# Altium schematic sheet 03_MCU_STM32.SchDoc
size A3; SheetNumber: 3; SheetTotal: 9
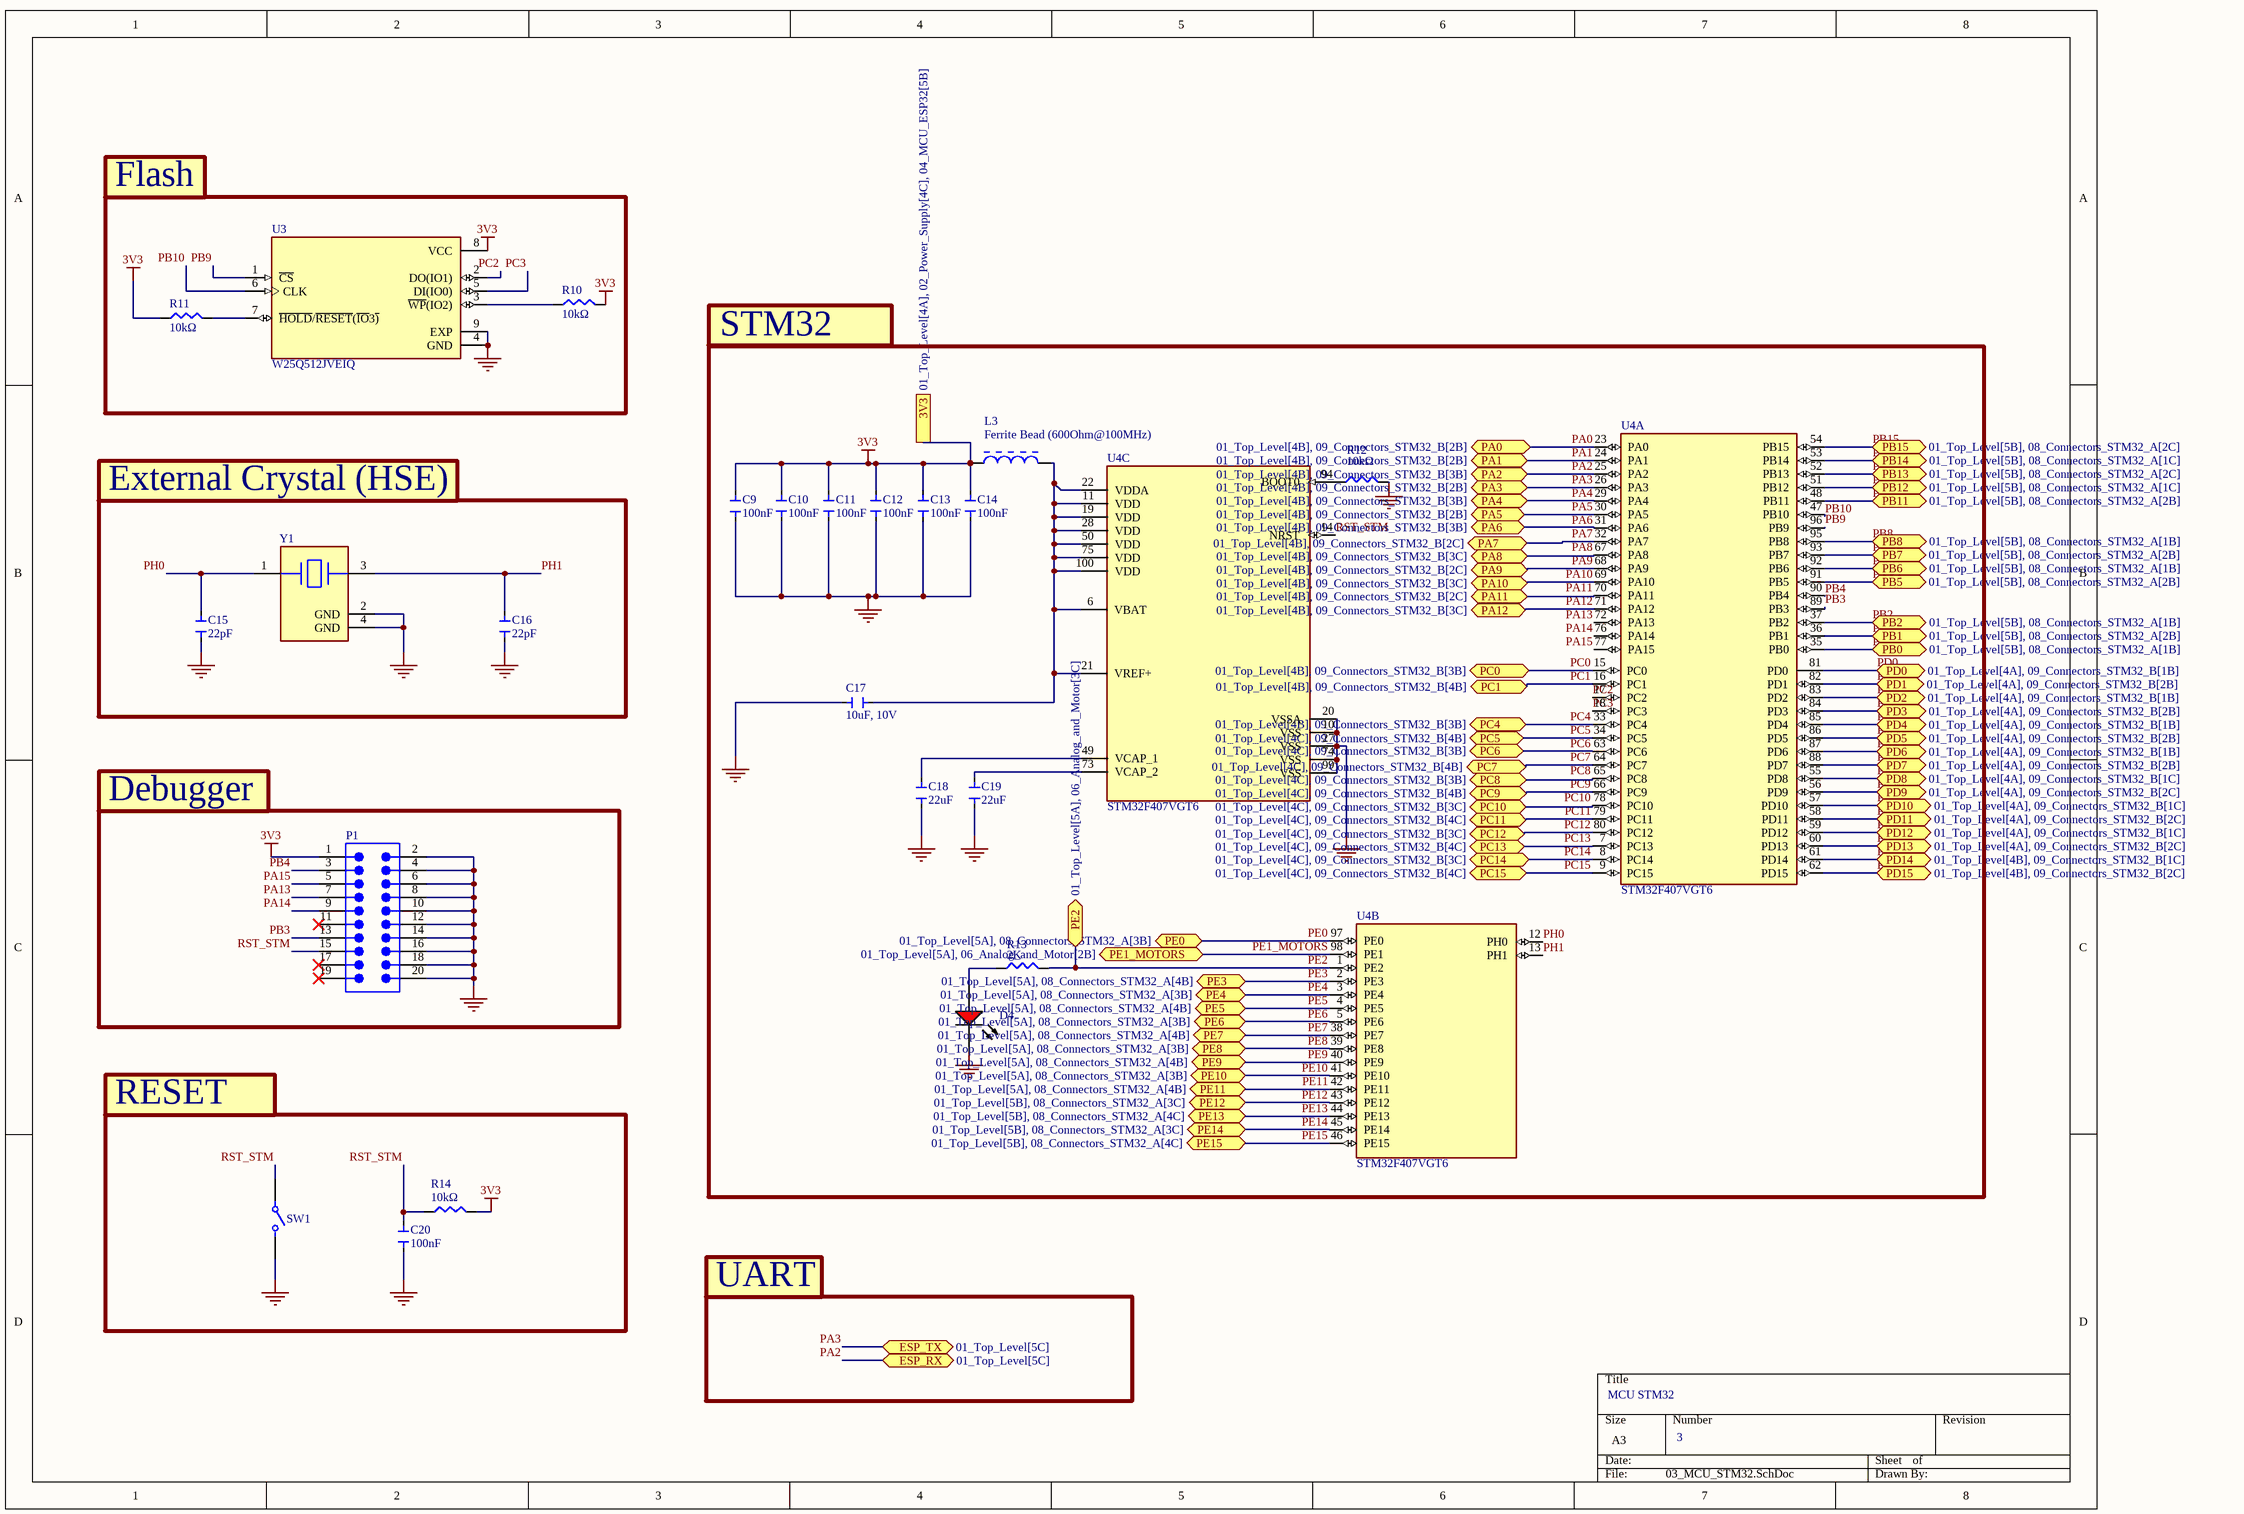
[diagram p0: 03_MCU_STM32.SchDoc]

## Parts
C9  100nF  [CAP_100nF]
C10  100nF  [CAP_100nF]
C11  100nF  [CAP_100nF]
C12  100nF  [CAP_100nF]
C13  100nF  [CAP_100nF]
C14  100nF  [CAP_100nF]
C15  22pF  [CAP_22uF]
C16  22pF  [CAP_22uF]
C17  10uF, 10V  [CAP_10uF]
C18  22uF  [CAP_22uF]
C19  22uF  [CAP_22uF]
C20  100nF  [CAP_100nF]
D4  304090041  [LED-2P-2.28-3MM_A]  (value not drawn)
L3  BLM18AG121SN1D  [MURA-BLM18-F-H1-CHIP-2_V]  (value not drawn)
P1  61002021121  [61002021121]  (value not drawn)
R10  10kΩ  [RES_10K]
R11  10kΩ  [RES_10K]
R12  10kΩ  [RES_10K]
R13  2K  [RES_2K]
R14  10kΩ  [RES_10K]
SW1  EVP-BD6C1A000  [FP-EVP-BD6C1A000-MFG]  (value not drawn)
U3  W25Q512JVEIQ  [SON127P600X800X80-9N]
U4  STM32F407VGT6  [QFP50P1600X1600X160-100N]  (parts A,B,C of 3)
Y1  ABM11AIG-32.000MHZ-4-T3  [FP-ABM11AIG-MFG]  (value not drawn)

## Blocks framed on the sheet
Flash: R10 R11 U3
STM32: C9-C14 C17-C19 D4 L3 R12 R13 U4
External Crystal (HSE): C15 C16 Y1
Debugger: P1
RESET: C20 R14 SW1

## Ports
3V3 (see 01_Top_Level[4A], 02_Power_Supply[4C], 04_MCU_ESP32[5B]), ESP_RX (bidir, see 01_Top_Level[5C]), ESP_TX (bidir, see 01_Top_Level[5C]), PA0 (bidir, see 01_Top_Level[4B], 09_Connectors_STM32_B[2B]), PA1 (bidir, see 01_Top_Level[4B], 09_Connectors_STM32_B[2B]), PA2 (bidir, see 01_Top_Level[4B], 09_Connectors_STM32_B[3B]), PA3 (bidir, see 01_Top_Level[4B], 09_Connectors_STM32_B[2B]), PA4 (bidir, see 01_Top_Level[4B], 09_Connectors_STM32_B[3B]), PA5 (bidir, see 01_Top_Level[4B], 09_Connectors_STM32_B[2B]), PA6 (bidir, see 01_Top_Level[4B], 09_Connectors_STM32_B[3B]), PA7 (bidir, see 01_Top_Level[4B], 09_Connectors_STM32_B[2C]), PA8 (bidir, see 01_Top_Level[4B], 09_Connectors_STM32_B[3C]), PA9 (bidir, see 01_Top_Level[4B], 09_Connectors_STM32_B[2C]), PA10 (bidir, see 01_Top_Level[4B], 09_Connectors_STM32_B[3C]), PA11 (bidir, see 01_Top_Level[4B], 09_Connectors_STM32_B[2C]), PA12 (bidir, see 01_Top_Level[4B], 09_Connectors_STM32_B[3C]), PB0 (bidir, see 01_Top_Level[5B], 08_Connectors_STM32_A[1B]), PB1 (bidir, see 01_Top_Level[5B], 08_Connectors_STM32_A[2B]), PB2 (bidir, see 01_Top_Level[5B], 08_Connectors_STM32_A[1B]), PB5 (bidir, see 01_Top_Level[5B], 08_Connectors_STM32_A[2B]), PB6 (bidir, see 01_Top_Level[5B], 08_Connectors_STM32_A[1B]), PB7 (bidir, see 01_Top_Level[5B], 08_Connectors_STM32_A[2B]), PB8 (bidir, see 01_Top_Level[5B], 08_Connectors_STM32_A[1B]), PB11 (bidir, see 01_Top_Level[5B], 08_Connectors_STM32_A[2B]), PB12 (bidir, see 01_Top_Level[5B], 08_Connectors_STM32_A[1C]), PB13 (bidir, see 01_Top_Level[5B], 08_Connectors_STM32_A[2C]), PB14 (bidir, see 01_Top_Level[5B], 08_Connectors_STM32_A[1C]), PB15 (bidir, see 01_Top_Level[5B], 08_Connectors_STM32_A[2C]), PC0 (bidir, see 01_Top_Level[4B], 09_Connectors_STM32_B[3B]), PC1 (bidir, see 01_Top_Level[4B], 09_Connectors_STM32_B[4B]), PC4 (bidir, see 01_Top_Level[4B], 09_Connectors_STM32_B[3B]), PC5 (bidir, see 01_Top_Level[4C], 09_Connectors_STM32_B[4B]), PC6 (bidir, see 01_Top_Level[4C], 09_Connectors_STM32_B[3B]), PC7 (bidir, see 01_Top_Level[4C], 09_Connectors_STM32_B[4B]), PC8 (bidir, see 01_Top_Level[4C], 09_Connectors_STM32_B[3B]), PC9 (bidir, see 01_Top_Level[4C], 09_Connectors_STM32_B[4B]), PC10 (bidir, see 01_Top_Level[4C], 09_Connectors_STM32_B[3C]), PC11 (bidir, see 01_Top_Level[4C], 09_Connectors_STM32_B[4C]), PC12 (bidir, see 01_Top_Level[4C], 09_Connectors_STM32_B[3C]), PC13 (bidir, see 01_Top_Level[4C], 09_Connectors_STM32_B[4C]), PC14 (bidir, see 01_Top_Level[4C], 09_Connectors_STM32_B[3C]), PC15 (bidir, see 01_Top_Level[4C], 09_Connectors_STM32_B[4C]), PD0 (bidir, see 01_Top_Level[4A], 09_Connectors_STM32_B[1B]), PD1 (bidir, see 01_Top_Level[4A], 09_Connectors_STM32_B[2B]), PD2 (bidir, see 01_Top_Level[4A], 09_Connectors_STM32_B[1B]), PD3 (bidir, see 01_Top_Level[4A], 09_Connectors_STM32_B[2B]), PD4 (bidir, see 01_Top_Level[4A], 09_Connectors_STM32_B[1B]), PD5 (bidir, see 01_Top_Level[4A], 09_Connectors_STM32_B[2B]), PD6 (bidir, see 01_Top_Level[4A], 09_Connectors_STM32_B[1B]), PD7 (bidir, see 01_Top_Level[4A], 09_Connectors_STM32_B[2B]), PD8 (bidir, see 01_Top_Level[4A], 09_Connectors_STM32_B[1C]), PD9 (bidir, see 01_Top_Level[4A], 09_Connectors_STM32_B[2C]), PD10 (bidir, see 01_Top_Level[4A], 09_Connectors_STM32_B[1C]), PD11 (bidir, see 01_Top_Level[4A], 09_Connectors_STM32_B[2C]), PD12 (bidir, see 01_Top_Level[4A], 09_Connectors_STM32_B[1C]), PD13 (bidir, see 01_Top_Level[4A], 09_Connectors_STM32_B[2C]), PD14 (bidir, see 01_Top_Level[4B], 09_Connectors_STM32_B[1C]), PD15 (bidir, see 01_Top_Level[4B], 09_Connectors_STM32_B[2C]), PE0 (bidir, see 01_Top_Level[5A], 08_Connectors_STM32_A[3B]), PE1_MOTORS (bidir, see 01_Top_Level[5A], 06_Analog_and_Motor[2B]), PE2 (bidir, see 01_Top_Level[5A], 06_Analog_and_Motor[3C]), PE3 (bidir, see 01_Top_Level[5A], 08_Connectors_STM32_A[4B]), PE4 (bidir, see 01_Top_Level[5A], 08_Connectors_STM32_A[3B]), PE5 (bidir, see 01_Top_Level[5A], 08_Connectors_STM32_A[4B]), PE6 (bidir, see 01_Top_Level[5A], 08_Connectors_STM32_A[3B]), PE7 (bidir, see 01_Top_Level[5A], 08_Connectors_STM32_A[4B]), PE8 (bidir, see 01_Top_Level[5A], 08_Connectors_STM32_A[3B]), PE9 (bidir, see 01_Top_Level[5A], 08_Connectors_STM32_A[4B]), PE10 (bidir, see 01_Top_Level[5A], 08_Connectors_STM32_A[3B]), PE11 (bidir, see 01_Top_Level[5A], 08_Connectors_STM32_A[4B]), PE12 (bidir, see 01_Top_Level[5B], 08_Connectors_STM32_A[3C]), PE13 (bidir, see 01_Top_Level[5B], 08_Connectors_STM32_A[4C]), PE14 (bidir, see 01_Top_Level[5B], 08_Connectors_STM32_A[3C]), PE15 (bidir, see 01_Top_Level[5B], 08_Connectors_STM32_A[4C])

## Nets
3V3: C9.2 C10.2 C11.2 C12.2 C13.2 C14.2 L3.1 P1.1 R10.2 R11.1 R14.2 U3.8(VCC) ; port 3V3
GND: C9.1 C10.1 C11.1 C12.1 C13.1 C14.1 C15.1 C16.1 C17.1 C18.2 C19.2 C20.1 D4.2(K) P1.2 P1.4 P1.6 P1.8 P1.10 P1.12 P1.14 P1.16 P1.18 P1.20 R12.2 SW1.B U3.4(GND) U3.9(EXP) U4.10(VSS) U4.20(VSSA) U4.27(VSS) U4.74(VSS) U4.99(VSS) Y1.2(GND) Y1.4(GND)
PA0: U4.23(PA0) ; port PA0
PA1: U4.24(PA1) ; port PA1
PA2: U4.25(PA2) ; port PA2, port ESP_RX
PA3: U4.26(PA3) ; port PA3, port ESP_TX
PA4: U4.29(PA4) ; port PA4
PA5: U4.30(PA5) ; port PA5
PA6: U4.31(PA6) ; port PA6
PA7: U4.32(PA7) ; port PA7
PA8: U4.67(PA8) ; port PA8
PA9: U4.68(PA9) ; port PA9
PA10: U4.69(PA10) ; port PA10
PA11: U4.70(PA11) ; port PA11
PA12: U4.71(PA12) ; port PA12
PA13: P1.7 U4.72(PA13)
PA14: P1.9 U4.76(PA14)
PA15: P1.5 U4.77(PA15)
PB0: U4.35(PB0) ; port PB0
PB1: U4.36(PB1) ; port PB1
PB2: U4.37(PB2) ; port PB2
PB3: P1.13 U4.89(PB3)
PB4: P1.3 U4.90(PB4)
PB5: U4.91(PB5) ; port PB5
PB6: U4.92(PB6) ; port PB6
PB7: U4.93(PB7) ; port PB7
PB8: U4.95(PB8) ; port PB8
PB9: U3.1(~{CS}) U4.96(PB9)
PB10: U3.6(CLK) U4.47(PB10)
PB11: U4.48(PB11) ; port PB11
PB12: U4.51(PB12) ; port PB12
PB13: U4.52(PB13) ; port PB13
PB14: U4.53(PB14) ; port PB14
PB15: U4.54(PB15) ; port PB15
PC0: U4.15(PC0) ; port PC0
PC1: U4.16(PC1) ; port PC1
PC2: U3.2(DO(IO1)) U4.17(PC2)
PC3: U3.5(DI(IO0)) U4.18(PC3)
PC4: U4.33(PC4) ; port PC4
PC5: U4.34(PC5) ; port PC5
PC6: U4.63(PC6) ; port PC6
PC7: U4.64(PC7) ; port PC7
PC8: U4.65(PC8) ; port PC8
PC9: U4.66(PC9) ; port PC9
PC10: U4.78(PC10) ; port PC10
PC11: U4.79(PC11) ; port PC11
PC12: U4.80(PC12) ; port PC12
PC13: U4.7(PC13) ; port PC13
PC14: U4.8(PC14) ; port PC14
PC15: U4.9(PC15) ; port PC15
PD0: U4.81(PD0) ; port PD0
PD1: U4.82(PD1) ; port PD1
PD2: U4.83(PD2) ; port PD2
PD3: U4.84(PD3) ; port PD3
PD4: U4.85(PD4) ; port PD4
PD5: U4.86(PD5) ; port PD5
PD6: U4.87(PD6) ; port PD6
PD7: U4.88(PD7) ; port PD7
PD8: U4.55(PD8) ; port PD8
PD9: U4.56(PD9) ; port PD9
PD10: U4.57(PD10) ; port PD10
PD11: U4.58(PD11) ; port PD11
PD12: U4.59(PD12) ; port PD12
PD13: U4.60(PD13) ; port PD13
PD14: U4.61(PD14) ; port PD14
PD15: U4.62(PD15) ; port PD15
PE0: U4.97(PE0) ; port PE0
PE1_MOTORS: U4.98(PE1) ; port PE1_MOTORS
PE2: R13.2 U4.1(PE2) ; port PE2
PE3: U4.2(PE3) ; port PE3
PE4: U4.3(PE4) ; port PE4
PE5: U4.4(PE5) ; port PE5
PE6: U4.5(PE6) ; port PE6
PE7: U4.38(PE7) ; port PE7
PE8: U4.39(PE8) ; port PE8
PE9: U4.40(PE9) ; port PE9
PE10: U4.41(PE10) ; port PE10
PE11: U4.42(PE11) ; port PE11
PE12: U4.43(PE12) ; port PE12
PE13: U4.44(PE13) ; port PE13
PE14: U4.45(PE14) ; port PE14
PE15: U4.46(PE15) ; port PE15
PH0: C15.2 U4.12(PH0) Y1.1(1_Crystal)
PH1: C16.2 U4.13(PH1) Y1.3(2_Crystal)
RST_STM: C20.2 P1.15 R14.1 SW1.A U4.14(NRST)
NetC17_2: C17.2 L3.2 U4.6(VBAT) U4.11(VDD) U4.19(VDD) U4.21(VREF+) U4.22(VDDA) U4.28(VDD) U4.50(VDD) U4.75(VDD) U4.100(VDD)
NetC18_1: C18.1 U4.49(VCAP_1)
NetC19_1: C19.1 U4.73(VCAP_2)
NetD4_1: D4.1(A) R13.1
NetR10_1: R10.1 U3.3(~{WP}(IO2))
NetR11_2: R11.2 U3.7(~{HOLD}/~{RESET}(~{IO}3~{)})
NetR12_1: R12.1 U4.94(BOOT0)

Not connected (* = marked no-connect by the designer): P1 11* 17* 19*

## Notes on the sheet
- (near L3) Ferrite Bead (600Ohm@100MHz)
- UART
- MCU STM32
- 3

## Library data of the parts
C9-C14 C20 = CAP_100nF: CAP 100nF 50V X7R ±10% 0603 Ceramic Capacitors RoHS; manufacturer: YAGEO; manufacturer part number: CC0603KRX7R9BB104; value: 100nf; supplier: LCSC; supplier part number: C14663; ComponentLink1Description: Datasheet; ComponentLink1URL: https://www.lcsc.com/datasheet/C14663.pdf
C15 C16 C18 C19 = CAP_22uF: CAP 22uF 25V X5R ±20% 0805 Ceramic Capacitors RoHS; manufacturer: Samsung Electro-Mechanics; manufacturer part number: CL21A226MAYNNNE; ComponentLink1Description: Datasheet; ComponentLink1URL: https://www.lcsc.com/datasheet/C602037.pdf; Value: 22uF; supplier: LCSC; supplier part number: C602037
C17 = CAP_0402_10UF: CAP CER 10UF 10V X5R 0402; Manufacturer: Samsung Electro-Mechanics; Manufacturer Part Number: C307415; Dielectric Material: Ceramic; Multilayer: Yes; Tolerance  (fill in as +-): 20%; Supplier: LCSC; Supplier Part Number: 1276-6830-1-ND; RoHS: Yes; Category: Ceramic Capacitors; Stock: 1294909; Pricing: 1=0.33, 10=0.215, 50=0.1584, 100=0.129, 500=0.1018, 1000=0.08597, 2500=0.08145 (USD); Mounting Technology: Surface Mount; Pins: 2; Package Shape: Rectangular; Case/Package: 0402; Terminal Finish: Nickel; Min Operating Temperature: -55°C; Max Operating Temperature: 85°C; JESD-609 Code: e3; Value: 10uF; Capacitor Type: Ceramic; Packaging: Tape and Reel; Tolerance (fill in as +-): 20%; Rated DC Voltage (URdc): 10V; Temperature Characteristics Code: X5R; Termination: Wraparound; Reach SVHC Compliant: Yes; RoHS Compliant: Yes; ComponentLink1URL: https://datasheet.ciiva.com:443/pdfs/VipMasterIC/IC/SEMS/SEMS-S-A0008521219/SEMS-S-A0008521325-1.pdf?src-supplier=IHS+Markit; ComponentLink1Description: https://datasheet.ciiva.com:443/pdfs/VipMasterIC/IC/SEMS/SEMS-S-A0008521219/SEMS-S-A0008521325-1.pdf?src-supplier=IHS+Markit; ComponentLink2URL: http://www.samsungsem.com/kr/support/product-search/mlcc/CL05A106MP8NUB8.jsp?src-supplier=Digikey; ComponentLink2Description: http://www.samsungsem.com/kr/support/product-search/mlcc/CL05A106MP8NUB8.jsp?src-supplier=Digikey; ComponentLink3URL: https://datasheet.octopart.com/CL05A106MP8NUB8-Samsung-Electro-Mechanics-datasheet-136460857.pdf?src-supplier=Future+Electronics; ComponentLink3Description: https://datasheet.octopart.com/CL05A106MP8NUB8-Samsung-Electro-Mechanics-datasheet-136460857.pdf?src-supplier=Future+Electronics; LCSC Part Number: C307415
D4 = CMP-007-00007-2: Red LED, 80 mW, 30 mA, -25 to 85 degC, 2-Pin THD; Manufacturer: Shenzhen CGX; Package Description: 2-Pin Through Hole Device, Dia 3 mm, Pitch 2.28 mm; Datasheet URL: http://datasheet.octopart.com/304090041-Chengguangxing-datasheet-62330656.pdf; Mounting Technology: TH; Manufacturer URL: http://szcgx.com/; RoHS Compliant: Unknown; Datasheet Version: Sep-14; Case/Package: 304090041; Package Reference: 304090041
L3 = CMP-006-00004-3: Chip Ferrite Bead for General Use, 120 Ohm, 500 mA, -55 to 125 degC, 0603 (1608 Metric), RoHS, Tape and Reel; Manufacturer: Murata; Max Current Rating: 500mA; Tolerance: 25%; Impedance: 120Ohm; Resistance: 200mohm; Min Operating Temperature: -55°C; Package Reference: BLM18_H950-2; Max Operating Temperature: 125°C; Current Rating: 500mA; Core Material: Ferrite; Datasheet Version: Jun-12; Packaging: TapeandReel; Datasheet URL: https://statics3.seeedstudio.com/images/opl/datasheet/303010016.pdf; Package Quantity: 4000; Case/Package: 0603; RoHS Compliant: True
P1 = CMP-1502-01036-4: SMT Vertical Pin Header WR-PHD, Pitch 2.54 mm, Dual Row, 20 pins; Number of Positions: 20; Connector Type: Male Pin; Row Spacing: 2.54mm; Voltage Rating: 250V; Contact Resistance: 20mΩ; Current Rating: 3A; Gender: Male; Mount: Surface Mount; Max Operating Temperature: 105°C; Number of Rows: 2; Orientation: Vertical; Contact Plating: Gold; Lead Pitch: 2.54mm; Pitch: 2.54mm; Min Operating Temperature: -40°C; RoHS: Compliant; Color: Black; Operating Supply Voltage: 250V; Termination: Solder; Number of Contacts: 20; Contact Mating Length: 5.9944mm; Height: 10mm; Number of Pins: 20; Contact Material: Gold
R10-R12 R14 = RES_0603_10K: 100mW Thin Film Resistor ±0.1% ±10ppm/℃ 10kΩ 0603 Chip Resistor - Surface Mount ROHS; Manufacturer: Yageo Group; Manufacturer Part Number: RT0603BRB07169KL; Manufacturer: YAGEO; Temperature Coefficient: 10ppm/°C; Voltage Rating: 75V; Features: Moisture Resistant; Height: 450µm; Length: 1.6002mm; Lifecycle Status: Production; Max Operating Temperature: 155°C; Max Power Dissipation: 100mW; Min Operating Temperature: -55°C; Mounting Technology: Surface Mount; Number of Terminals: 2; Number of Terminations: 2; Packaging: Tape & Reel; Power Dissipation: 100mW; Power Rating: 100mW; REACH SVHC: Yes; Tolerance: 0.1%; Width: 800µm; Working Voltage: 75V; ComponentLink1URL: https://datasheet.octopart.com:443/RT0603BRB07169KL-Yageo-datasheet-176402239.pdf?src-supplier=IHS; ComponentLink1Description: https://datasheet.octopart.com:443/RT0603BRB07169KL-Yageo-datasheet-176402239.pdf?src-supplier=IHS; ComponentLink2URL: https://datasheet.octopart.com:443/RT0603BRB07169KL-Yageo-datasheet-96443642.pdf?src-supplier=Upverter; ComponentLink2Description: https://datasheet.octopart.com:443/RT0603BRB07169KL-Yageo-datasheet-96443642.pdf?src-supplier=Upverter; ComponentLink3URL: https://datasheet.octopart.com:443/RT0603BRB07169KL-Yageo-Group-datasheet-141265893.pdf?src-supplier=ODG+(Origin+Data+Global); ComponentLink3Description: https://datasheet.octopart.com:443/RT0603BRB07169KL-Yageo-Group-datasheet-141265893.pdf?src-supplier=ODG+(Origin+Data+Global); ComponentLink4URL: https://datasheet.octopart.com/RT0603BRB07169KL-Yageo-datasheet-86813807.pdf; ComponentLink4Description: https://datasheet.octopart.com/RT0603BRB07169KL-Yageo-datasheet-86813807.pdf; ComponentLink5URL: http://sigma.octopart.com:80/conflict_mineral_statement/Yageo-company-3.pdf?src-supplier=Compliance+Statements; ComponentLink5Description: http://sigma.octopart.com:80/conflict_mineral_statement/Yageo-company-3.pdf?src-supplier=Compliance+Statements; ComponentLink6URL: http://sigma.octopart.com:80/rohs_statement/Yageo-company-2.pdf?src-supplier=Compliance+Statements; ComponentLink6Description: http://sigma.octopart.com:80/rohs_statement/Yageo-company-2.pdf?src-supplier=Compliance+Statements; Supplier: LCSC; Supplier Part Number: C860143; Datasheet Link: https://www.lcsc.com/datasheet/C860143.pdf
R13 = RSE_0603_2K: 100mW 2KΩ 75V Thick Film Resistor ±100ppm/℃ ±1% 0603 Chip Resistor - Surface Mount RoHS; ComponentLink1Description: datasheet; ComponentLink1URL: https://www.lcsc.com/product-detail/C105588.html?s_z=n_resistance%2520100%2520ohm
SW1 = CMP-00287-74573419-1: EVP-BD6C1A000 Switch Tactile N.O. SPST Round Button J-Bend 0.05A 12VDC 3.5N SMD Automotive T/R; Contact Current Rating: 20mA; Life (Cycles): 100kcycles; Contact Resistance: 500mΩ; Voltage Rating (DC): 15V; Number of Positions: 2; Max Operating Temperature: 90°C; NexarPartId: 74573419; RoHS: Non-Compliant; Min Operating Temperature: -40°C; Height: 4.2mm; Operating Force: 3.5N; Mount: Surface Mount
U3 = W25Q512JVEIQ: FLASH - NOR Memory IC 512Mb (64M x 8) SPI - Quad I/O 133 MHz 8-WSON (8x6); MF: Winbond Electronics; SnapEDA_Link: https://www.snapeda.com/parts/W25Q512JVEIQ/Winbond/view-part/?ref=snap; Package: Package; Value: *; MP: W25Q512JVEIQ; Check_prices: https://www.snapeda.com/parts/W25Q512JVEIQ/Winbond/view-part/?ref=eda
U4 = STM32F407VGT6: ARMÂ® CortexÂ®-M4 STM32F4 Microcontroller IC 32-Bit Single-Core 168MHz 1MB (1M x 8) FLASH 100-LQFP (14x14); MF: STMicroelectronics; SnapEDA_Link: https://www.snapeda.com/parts/STM32F407VGT6/STMicroelectronics/view-part/?ref=snap; Package: LQFP-100 STMicroelectronics; Value: *; MP: STM32F407VGT6; Check_prices: https://www.snapeda.com/parts/STM32F407VGT6/STMicroelectronics/view-part/?ref=eda
Y1 = CMP-27762-011048-1: Crystal 32MHz ±30ppm 10pF SMD-4 2.5mm x 2mm Automotive; Frequency Stability: 100ppm; ESR (Equivalent Series Resistance): 80R; Max Operating Temperature: 125°C; Frequency Tolerance: 30ppm; Length: 0.098inch; Frequency: 32MHz; RoHS Compliant: Yes; Min Operating Temperature: -40°C; Width: 0.079inch; Load Capacitance: 10pF; Packaging: Tape and Reel; Height: 0.024inch; Mount: Surface Mount; Case/Package: SMD/SMT; Ratings: AEC-Q200